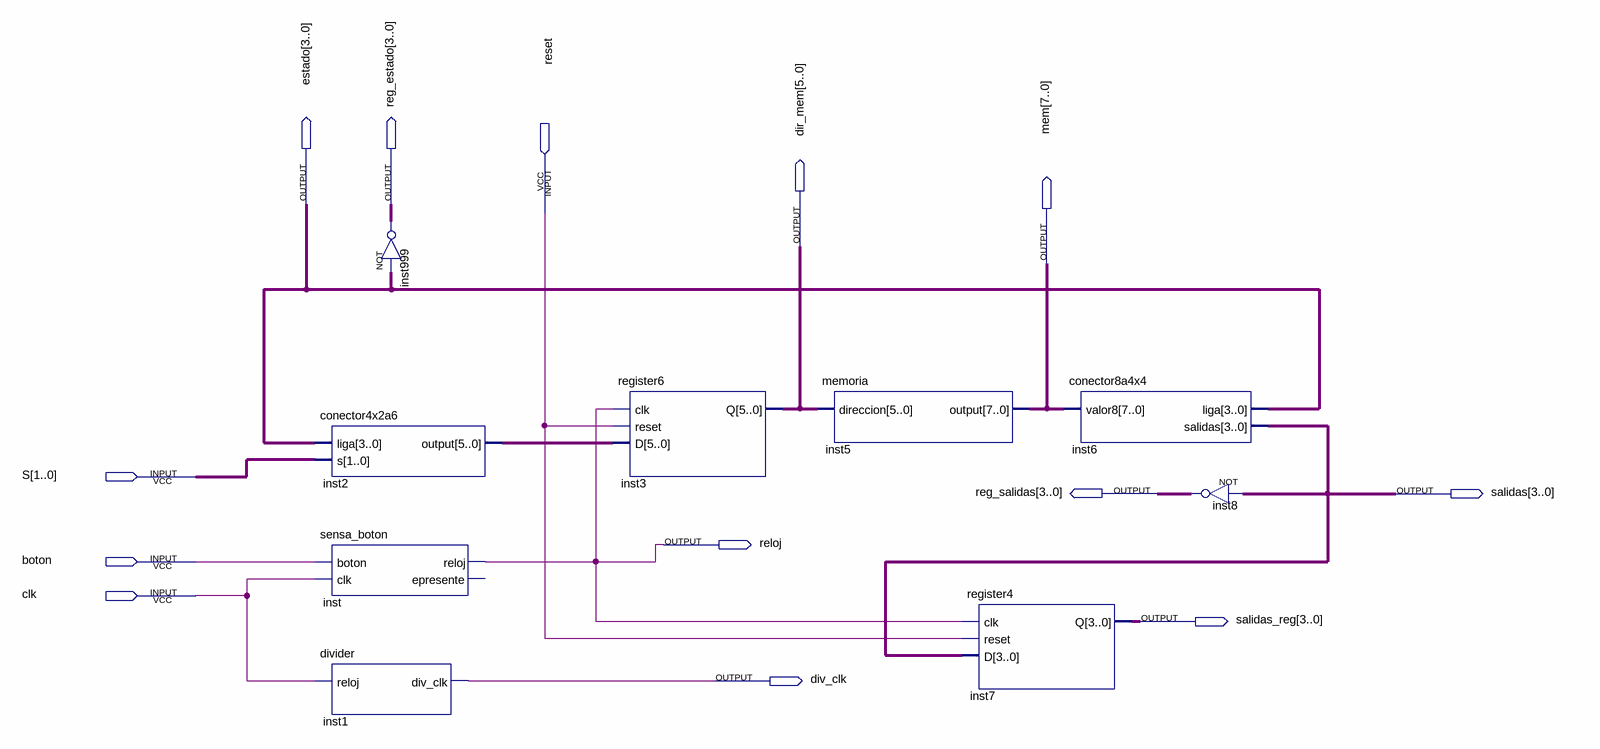
[diagram p0: schematic sheet]
// Quartus schematic Practica3.bdf as structural Verilog: 9 symbols, 13 pins
module Practica3 (
  input  reset,
  input  [1:0] S,
  input  boton,
  input  clk,
  output [3:0] estado,
  output [3:0] reg_estado,
  output [5:0] dir_mem,
  output [7:0] mem,
  output [3:0] reg_salidas,
  output [3:0] salidas,
  output reloj,
  output [3:0] salidas_reg,
  output div_clk
);

  wire [5:0] inst2_output;

  conector4x2a6 inst2 (.liga(estado), .s(S), .\output (inst2_output));
  sensa_boton inst (.boton(boton), .clk(clk), .reloj(reloj));  // open: epresente
  divider inst1 (.reloj(clk), .div_clk(div_clk));
  assign reg_estado = ~estado;  // NOT inst999, 4 bits wide
  register6 inst3 (.clk(reloj), .reset(reset), .D(inst2_output), .Q(dir_mem));
  memoria inst5 (.direccion(dir_mem), .\output (mem));
  register4 inst7 (.clk(reloj), .reset(reset), .D(salidas), .Q(salidas_reg));
  conector8a4x4 inst6 (.valor8(mem), .liga(estado), .salidas(salidas));
  assign reg_salidas = ~salidas;  // NOT inst8, 4 bits wide
endmodule
